# EAGLE schematic virtual_wall_lp (EAGLE 8.7.1)
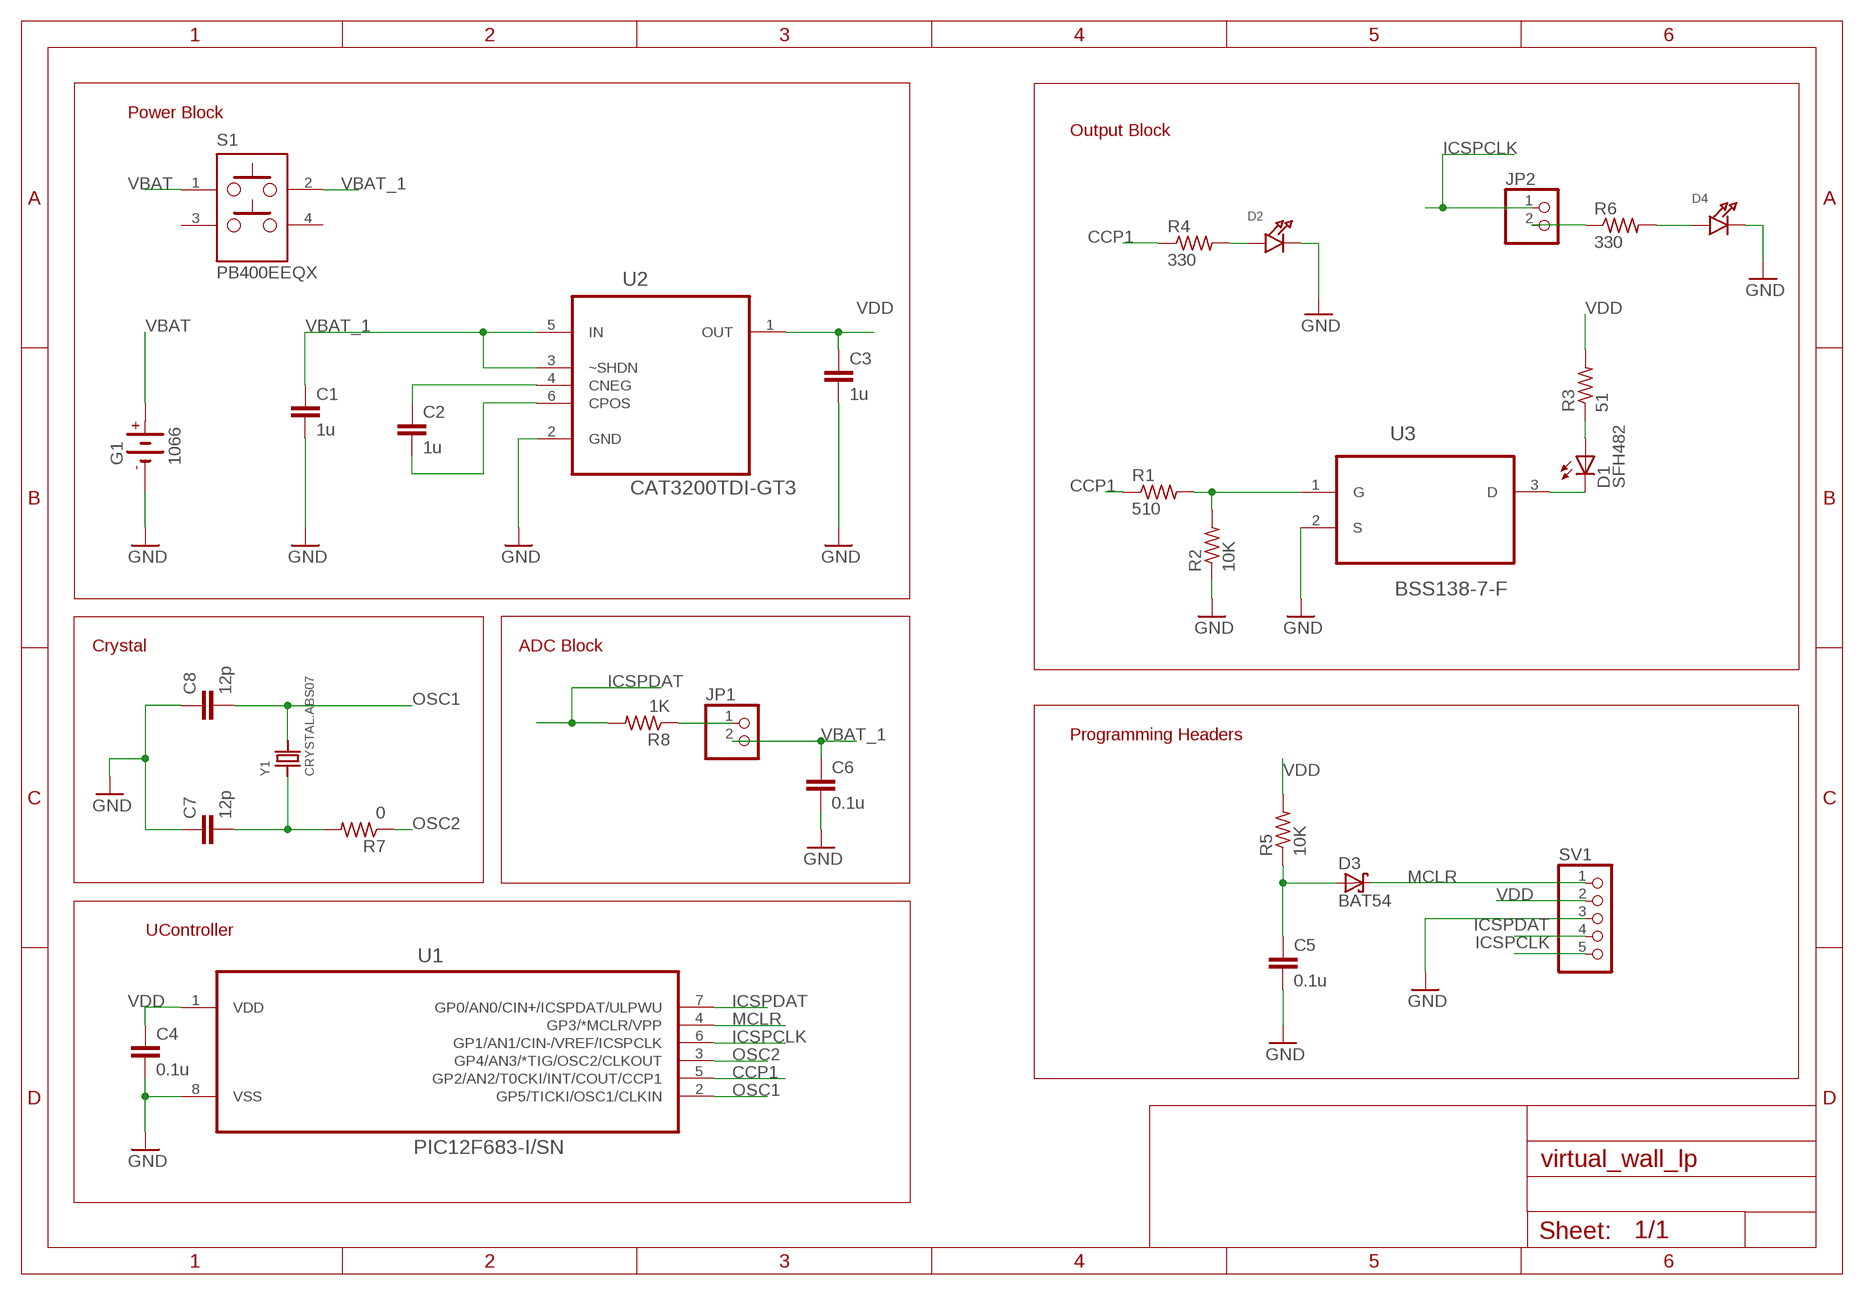
[diagram p0: schematic, sheet 1]

## Parts
C1  1u  C-EUC0603  [C0603]
C2  1u  C-EUC0603  [C0603]
C3  1u  C-EUC0603  [C0603]
C4  0.1u  C-EUC0603  [C0603]
C5  0.1u  C-EUC0603  [C0603]
C6  0.1u  C-EUC0603  [C0603]
C7  12p  C-EUC0603  [C0603]
C8  12p  C-EUC0603  [C0603]
D1  SFH482  [SFH482]
D2  LED1206  [CHIPLED_1206]
D3  BAT54  [SOT23]
D4  LED1206  [CHIPLED_1206]
G1  1066  [1066]
JP1  PINHD-1X2  [1X02]
JP2  PINHD-1X2  [1X02]
R1  510  R-US_R0603  [R0603]
R2  10K  R-US_R0603  [R0603]
R3  51  R-US_R0603  [R0603]
R4  330  R-US_R0603  [R0603]
R5  10K  R-US_R0603  [R0603]
R6  330  R-US_R0603  [R0603]
R7  0  R-US_R0603  [R0603]
R8  1K  R-US_R0603  [R0603]
S1  PB400EEQX  [SW_PB400EEQX]
SV1  PINHD-1X5  [1X05]
U1  PIC12F683-I/SN  [SOIC127P600X175-8N]
U2  CAT3200TDI-GT3  [SOT95P280X100-6N]
U3  BSS138-7-F  [SOT95P240X110-3N]
Y1  CRYSTAL.ABS07  [ABS07]

## Nets
CCP1 [led]: R1.1 R4.1 U1.5(GP2/AN2/T0CKI/INT/COUT/CCP1)
GND [power]: C1.2 C3.2 C4.2 C5.2 C6.2 C7.1 C8.1 D2.C D4.C G1.- R2.1 SV1.3 U1.8(VSS) U2.2(GND) U3.2(S)
ICSPCLK [led]: JP2.1 SV1.5 U1.6(GP1/AN1/CIN-/VREF/ICSPCLK)
ICSPDAT: R8.2 SV1.4 U1.7(GP0/AN0/CIN+/ICSPDAT/ULPWU)
MCLR: D3.3(K) SV1.1 U1.4(GP3/*MCLR/VPP)
N$1: C2.1 U2.4(CNEG)
N$3: R1.2 R2.2 U3.1(G)
N$4: C2.2 U2.6(CPOS)
N$5: D2.A R4.2
N$6: D1.A R3.1
N$7: D1.K(C) U3.3(D)
N$8: C5.1 D3.1(A) R5.1
N$9: C7.2 R7.2 Y1.1
N$11: D4.A R6.2
N$13 [led]: JP2.2 R6.1
N$14: JP1.1 R8.1
OSC1: C8.2 U1.2(GP5/TICKI/OSC1/CLKIN) Y1.2
OSC2: R7.1 U1.3(GP4/AN3/*TIG/OSC2/CLKOUT)
VBAT [power]: G1.+ S1.1
VBAT_1 [power]: C1.1 C6.1 JP1.2 S1.2 U2.3(~SHDN) U2.5(IN)
VDD [power]: C3.1 C4.1 R3.2 R5.2 SV1.2 U1.1(VDD) U2.1(OUT)
Unconnected: S1.3 S1.4

## Notes on the sheet
- Power Block
- Output Block
- Crystal | ADC Block
- Programming Headers
- UController

## Library data of the parts
C1-C8 = resistor:C-EU: CAPACITOR, European symbol
D1 = led:SFH482: IR LED infrared emitting diode, Infineon
D2 D4 = microbuilder:LED: LED 0603 - 0603 Surface Mount Package 2mA: Green LED - Low Power (3.9mcd, 2ma, 1.7Vf) - Digikey: 475-2709-2-ND Orange LED - Low Power (9.8mcd, 2ma, 1.8Vf) - Digikey: 475-1194-2-ND Red LED - Low Power (5mcd, 2ma, 1.8Vf) - Digikey: 475-1195-2-ND Yellow LED - Low Power (7mcd, 2ma, 1.8Vf) - Digikey: 475-1196-2-ND 5mA: Blue LED - Low Power (17mcd, 5ma, 2.9Vf) - Digikey: LNJ937W8CRACT-ND 0805 - 0805 Surface Mount Package 2mA: Red LED (8.8mcd, 2mA, 1.8Vf, Clear) - Low Power [Digikey: 475-2510-1-ND] Green LED (5mcd, 2mA, 1.8Vf, Clear) - Low Power [Digikey: 475-2730-1-ND] Yellow LED (11.3mcd, 2mA, 1.8Vf, Clear) - Low Power [Digikey: 475-2555-1-ND] 20mA: Red LED (104mcd, 20mA, Diffused) - LS R976 [Digikey: 475-1278-6-ND] Red LED (12mcd, 20mA, 2.0Vf, Clear) - APT2012EC [Digikey: 754-1128-1-ND] Green LED (15mcd, 20mA, 2.2Vf, Clear) - APT2012GC [Digikey: 754-1131-1-ND] Orange LED (160mcd, 20mA, 2.1Vf, Clear) - APT2012SECK [Digikey: 754-1130-1-ND] 1206 - 1206 Surface Mount Package Green LED (26mcd, 20mA, Diffused) - LG N971 [Digikey: 475-1407-6-ND] Red LED (15mcd, 20mA, Diffused) - LH N974 [Digikey: 475-1416-6-ND]
D3 = NXP_60_26022015:BAT54: Schottky barrier diode Planar Schottky barrier diode encapsulated in small plastic SMD packages. Single diodes and double diodes with different pinning are available AAL Eindhoven MK
G1 = 1066:1066: Keystone 1066 Li Coin Cell Holder; AVAILABILITY: Good; DESCRIPTION: Coin Cell Holder; 20 mm; 0.896 in.; Glass Filled Nylon; Tin Plate; 1; MF: Greenlee Communications; MP: 1066; PACKAGE: None; PRICE: 1.25 USD
JP1 JP2 = pinhead:PINHD-1X2: PIN HEADER
R1-R8 = rcl:R-US_: RESISTOR, American symbol; SPICEPREFIX: R
S1 = PB400EEQX:PB400EEQX: Right Angle Pushbutton Switch; AVAILABILITY: Warning; DESCRIPTION: Right Angle Pushbutton Switch; MF: E-Switch; MP: PB400EEQX; PACKAGE: None; PRICE: 0.96 USD
SV1 = pinhead:PINHD-1X5: PIN HEADER
U1 = Microchip_By_element14_Batch_1:PIC12F683-I/SN: IC, 8BIT MCU, PIC12, 20MHZ; MPN: PIC12F683-I/SN; OC_FARNELL: 9759042; OC_NEWARK: 61K3434; PACKAGE: SOIC-8; SUPPLIER: MICROCHIP
U2 = CAT3200TDI-GT3:CAT3200TDI-GT3: DC-DC Converter; AVAILABILITY: Good; DESCRIPTION: Regulated Charge Pump, Low Noise, DC-DC Converter; MF: ON Semiconductor; MP: CAT3200TDI-GT3; PACKAGE: TSOT-23-6 ON Semiconductor; PRICE: 0.79 USD
U3 = diodes_inc:BSS138-7-F: ENHANCEMENT MODE MOSFET; MPN: BSS138-7-F; OC_FARNELL: 1843693; OC_NEWARK: 12T1442; PACKAGE: SOT-23-3; SUPPLIER: DIODES INC.
Y1 = abracon-cmonr:CRYSTAL

## Net classes
0 default: width 0.305 mm
1 power: width 1.016 mm, clearance 0.254 mm